# Altium schematic sheet Pg1 Top Sheet and Micro.SchDoc: BMS - Top Cell
size Letter; Organization: Kettering University; Address1: EV Kartz; Address2: Battery; Address3: Flint, MI; Address4: United States of America; DocumentNumber: 1; Revision: 1; SheetNumber: 1; SheetTotal: 1
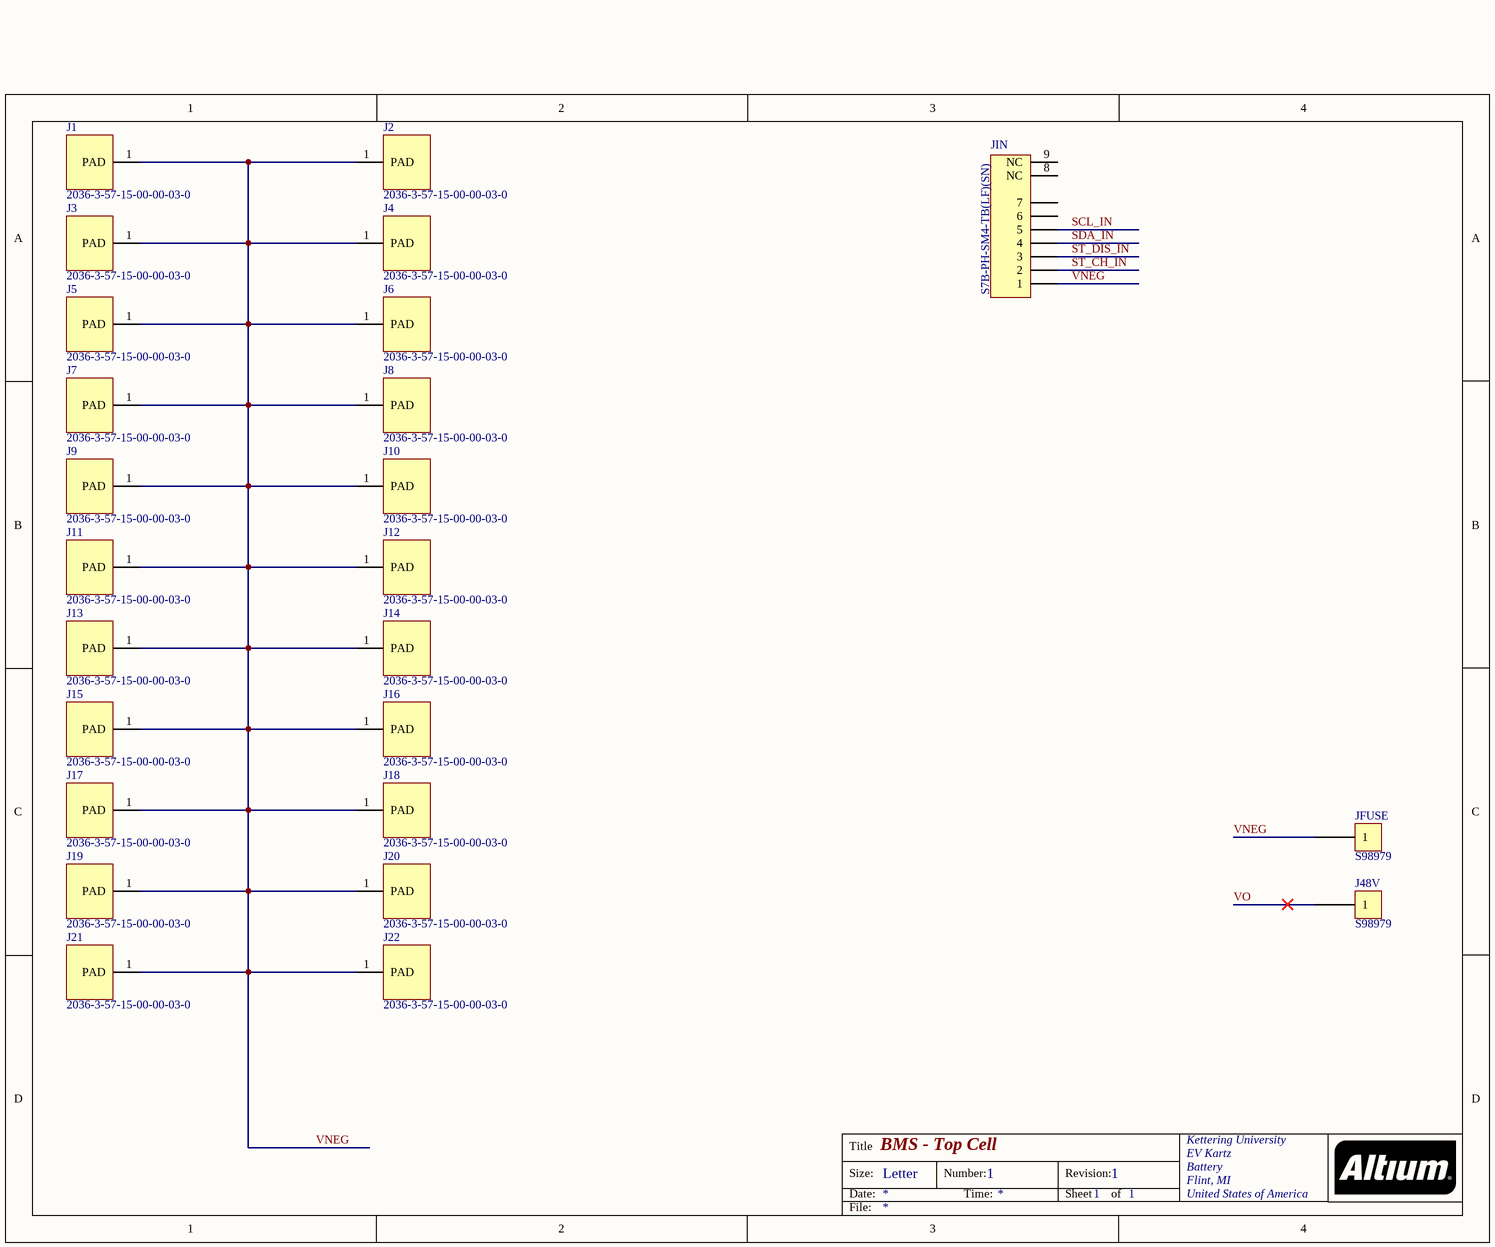
[diagram p0: Pg1 Top Sheet and Micro.SchDoc]

## Parts
J1  2036-3-57-15-00-00-03-0  [6mm Pad]
J2  2036-3-57-15-00-00-03-0  [6mm Pad]
J3  2036-3-57-15-00-00-03-0  [6mm Pad]
J4  2036-3-57-15-00-00-03-0  [6mm Pad]
J5  2036-3-57-15-00-00-03-0  [6mm Pad]
J6  2036-3-57-15-00-00-03-0  [6mm Pad]
J7  2036-3-57-15-00-00-03-0  [6mm Pad]
J8  2036-3-57-15-00-00-03-0  [6mm Pad]
J9  2036-3-57-15-00-00-03-0  [6mm Pad]
J10  2036-3-57-15-00-00-03-0  [6mm Pad]
J11  2036-3-57-15-00-00-03-0  [6mm Pad]
J12  2036-3-57-15-00-00-03-0  [6mm Pad]
J13  2036-3-57-15-00-00-03-0  [6mm Pad]
J14  2036-3-57-15-00-00-03-0  [6mm Pad]
J15  2036-3-57-15-00-00-03-0  [6mm Pad]
J16  2036-3-57-15-00-00-03-0  [6mm Pad]
J17  2036-3-57-15-00-00-03-0  [6mm Pad]
J18  2036-3-57-15-00-00-03-0  [6mm Pad]
J19  2036-3-57-15-00-00-03-0  [6mm Pad]
J20  2036-3-57-15-00-00-03-0  [6mm Pad]
J21  2036-3-57-15-00-00-03-0  [6mm Pad]
J22  2036-3-57-15-00-00-03-0  [6mm Pad]
J48V  S98979  [S98979]
JFUSE  S98979  [S98979]
JIN  S7B-PH-SM4-TB(LF)(SN)  [JST-PH-S7]

## Nets
SCL_IN: JIN.5
SDA_IN: JIN.4
ST_CH_IN: JIN.2
ST_DIS_IN: JIN.3
VNEG: J1.1(PAD) J2.1(PAD) J3.1(PAD) J4.1(PAD) J5.1(PAD) J6.1(PAD) J7.1(PAD) J8.1(PAD) J9.1(PAD) J10.1(PAD) J11.1(PAD) J12.1(PAD) J13.1(PAD) J14.1(PAD) J15.1(PAD) J16.1(PAD) J17.1(PAD) J18.1(PAD) J19.1(PAD) J20.1(PAD) J21.1(PAD) J22.1(PAD) JFUSE.1 JIN.1
VO: J48V.1

Not connected (* = marked no-connect by the designer): JIN 6 7 8(NC) 9(NC)

## Notes on the sheet
- Title
- Size:
- Date:
- Letter
- Number:
- Time:
- Revision:
- Sheet
- of
- File:

## Library data of the parts
J1-J22 = 2036-3-57-15-00-00-03-0: Hardware, Sprint Contact Surface; Supplier 1: Digi-Key; Supplier Part Number 1: 54-2036-3-57-15-00-00-03-0CT-ND
J48V JFUSE = S98979: Screw Terminal M8, 360A; Supplier 1: Digi-Key; Supplier Part Number 1: 2101-S98979-ND
JIN = S7B-PH-SM4-TB(LF)(SN): Header, JST, 7-Pin, Right-Angle, PH, Surface Mount; Category: J; Supplier 1: Digi-Key; Supplier Part Number 1: 455-1754-1-ND